# Altium schematic sheet 12-Charging LED Indicator.SchDoc
size A
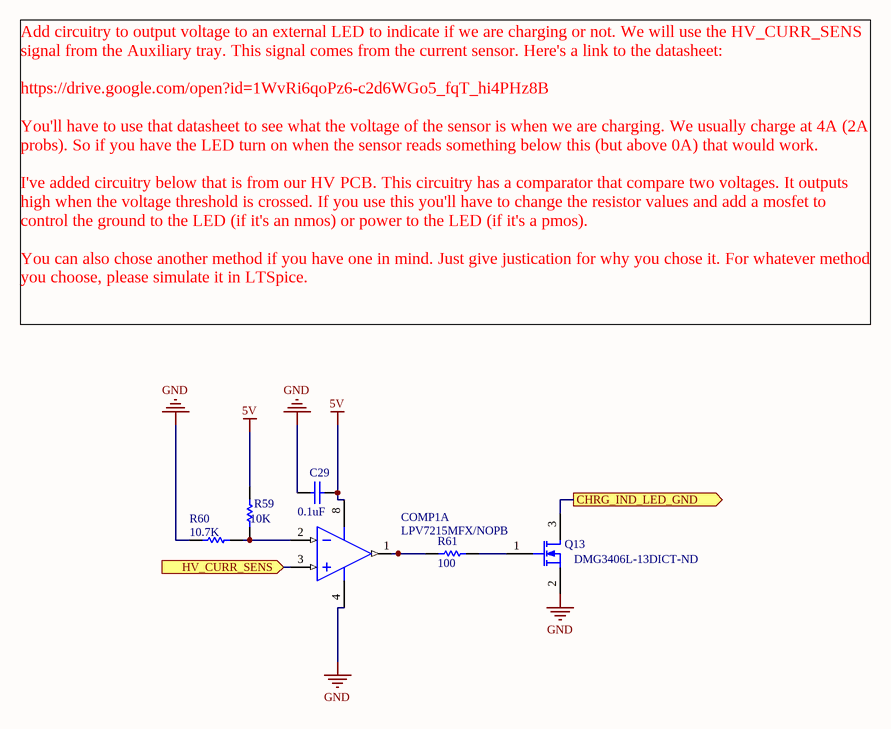
[diagram p0: 12-Charging LED Indicator.SchDoc]

## Parts
C29  0.1uF  [1206 (3216 Metric)]
COMP1  LPV7215MFX/NOPB  [SOIC-SN8_M]  (part A of 2)
Q13  Supplier Part Number 1: DMG3406L-13DICT-ND  [SOT-23_N]
R59  10K  [1206 (3216 Metric)]
R60  10.7K  [1206 (3216 Metric)]
R61  100  [1206 (3216 Metric)]

## Ports
CHRG_IND_LED_GND (out), HV_CURR_SENS (in)

## Nets
5V: C29.2 COMP1.8(VDD) R59.1
GND: C29.1 COMP1.4(VSS) Q13.2(S) R60.1
CHRG_IND_LED_GND: Q13.3(D) ; port CHRG_IND_LED_GND
HV_CURR_SENS: COMP1.3(INA+) ; port HV_CURR_SENS
NetCOMP1_1: COMP1.1(OUTA) R61.1
NetCOMP1_2: COMP1.2(INA-) R59.2 R60.2
NetQ13_1: Q13.1(G) R61.2

## Notes on the sheet
- Add circuitry to output voltage to an external LED to indicate if we are charging or not. We will use the HV_CURR_SENS signal from the Auxiliary tray. This signal comes from the current sensor. Here's a link to the datasheet:
  https://drive.google.com/open?id=1WvRi6qoPz6-c2d6WGo5_fqT_hi4PHz8B
  You'll have to use that datasheet to see what the voltage of the sensor is when we are charging. We usually charge at 4A (2A probs). So if you have the LED turn on when the sensor reads something below this (but above 0A) that would work.
  I've added circuitry below that is from our HV PCB. This circuitry has a comparator that compare two voltages. It outputs high when the voltage threshold is crossed. If you use this you'll have to change the resistor values and add a mosfet to control the ground to the LED (if it's an nmos) or power to the LED (if it's a pmos).
  You can also chose another method if you have one in mind. Just give justication for why you chose it. For whatever method you choose, please simulate it in LTSpice.

## Library data of the parts
C29 = Cap: CGA5L4X7T2W104M160AA: CAP CER 0.1UF 450V X7T 1206; Published: 8-Jun-2000; LatestRevisionDate: 17-Jul-2002; LatestRevisionNote: Re-released for DXP Platform.; PackageReference: RAD-0.3; Publisher: Altium Limited; PackageDescription: Radial Cap, Thru-Hole; 2 Leads; 0.3 in Pin Spacing; Value: 0.1uF; Supplier 1: Digi-Key; Supplier Part Number 1: 445-12959-1-ND
COMP1 = CMP-0187-00236-3: None; Quiescent Current: 130uA; Input Bias Current: 1pA; Min Supply Voltage: 1.8V; Propagation Delay: 80ns; Output Type: TTL; Number of Channels: 2; Power Supply Rejection Ratio (PSRR): 70dB; Input Offset Voltage (Vos): 10mV; Output Current: 50mA; Hysteresis: 5mV; Max Supply Voltage: 5.5V; Common Mode Rejection Ratio: 66dB; Number of Pins: 8; Packaging: Tape and Reel; Max Operating Temperature: 125°C; Technology: CMOS; Number of Elements: 2; Type: General Purpose; Package Quantity: 3300; Min Operating Temperature: -40°C; RoHS Compliant: Yes; Lead Free: Lead Free; Case/Package: SOIC; Mount: Surface Mount; Radiation Hardening: No
Q13 = MOSFET-N: N-Channel MOSFET; Manufacturer: Infineon Technologies; Manufacturer Part Number: IPD075N03L G; FET Type: MOSFET N-Channel, Metal Oxide; FET Feature: Logic Level Gate; Drain to Source Voltage (Vdss): 30V; Current - Continuous Drain (Id) @ 25°C: 50A (Tc); Rds On (Max) @ Id, Vgs: 7.5 mOhm @ 30A, 10V; Vgs(th) (Max) @ Id: 2.2V @ 250µA; Gate Charge (Qg) @ Vgs: 18nC @ 10V; Input Capacitance (Ciss) @ Vds: 1900pF @ 15V; Power - Max: 47W; Published: 8-Jun-2000; LatestRevisionDate: 17-Jul-2002; LatestRevisionNote: Re-released for DXP Platform.; PackageVersion: 1995/1996; PackageReference: E3; Publisher: Altium Limited; PackageDescription: TO, Flat Index; 3 In-Line, Axial Leads; Body Dia. 4.6mm; Lead Dia. 0.5 mm (max); RoHS: RoHS Compliant; Category: Discrete Semiconductor Products; Packaging: Cut Tape (CT); Mounting Type: Surface Mount; Package / Case: TO-252-3, DPak (2 Leads + Tab), SC-63; Supplier Device Package: PG-TO252-3; ComponentLink1URL: http://www.infineon.com/dgdl/Infineon-IPD075N03LG-DS-v02_01-en.pdf?folderId=5546d4694909da4801490a07012f053b&fileId=db3a30431936bc4b011951d824f83aeb; ComponentLink1Description: http://www.infineon.com/dgdl/Infineon-IPD075N03LG-DS-v02_01-en.pdf?folderId=5546d4694909da4801490a07012f053b&fileId=db3a30431936bc4b011951d824f83aeb; ComponentLink2URL: http://www.semicon.toshiba.co.jp/info/docget.jsp?type=datasheet&lang=en&pid=SSM3K329R; ComponentLink2Description: http://www.semicon.toshiba.co.jp/info/docget.jsp?type=datasheet&lang=en&pid=SSM3K329R; Supplier 1: Digi-Key
R59 = Res1: Published: 8-Jun-2000; LatestRevisionDate: 17-Jul-2002; LatestRevisionNote: Re-released for DXP Platform.; PackageReference: AXIAL-0.3; Publisher: Altium Limited; PackageDescription: Axial Device, Thru-Hole; 2 Leads; 0.3 in Pin Spacing; Value: 10K; Supplier 1: Digi-Key; Supplier Part Number 1: RMCF1206FT10K0CT-ND
R60 = Res1: KTR18EZPF1501: RES SMD 1.5K OHM 1% 1/4W 1206; Published: 8-Jun-2000; LatestRevisionDate: 17-Jul-2002; LatestRevisionNote: Re-released for DXP Platform.; PackageReference: AXIAL-0.3; Publisher: Altium Limited; PackageDescription: Axial Device, Thru-Hole; 2 Leads; 0.3 in Pin Spacing; Value: 10.7K; Supplier 1: Digi-Key; Supplier Part Number 1: RNCP1206FTD10K7CT-ND
R61 = Res1: KTR18EZPJ101: RES SMD 100 OHM 5% 1/4W 1206; Published: 8-Jun-2000; LatestRevisionDate: 17-Jul-2002; LatestRevisionNote: Re-released for DXP Platform.; PackageReference: AXIAL-0.3; Publisher: Altium Limited; PackageDescription: Axial Device, Thru-Hole; 2 Leads; 0.3 in Pin Spacing; Value: 100; Supplier 1: Digi-Key; Supplier Part Number 1: RHM100PCT-ND